# EasyEDA Pro project ProPrj_3PA1030_2025-11-07.epro

# Schematic Schematic1

## Sheets
1 ADC1: Board Name: Board1; Create Date: 2025-04-20; Page Name: ADC1; Project Name: 3PA1030; Schematic Name: Schematic1; Update Date: 2025-04-21; Company: 嘉立创EDA; Page Size: A4; Version: V1.0
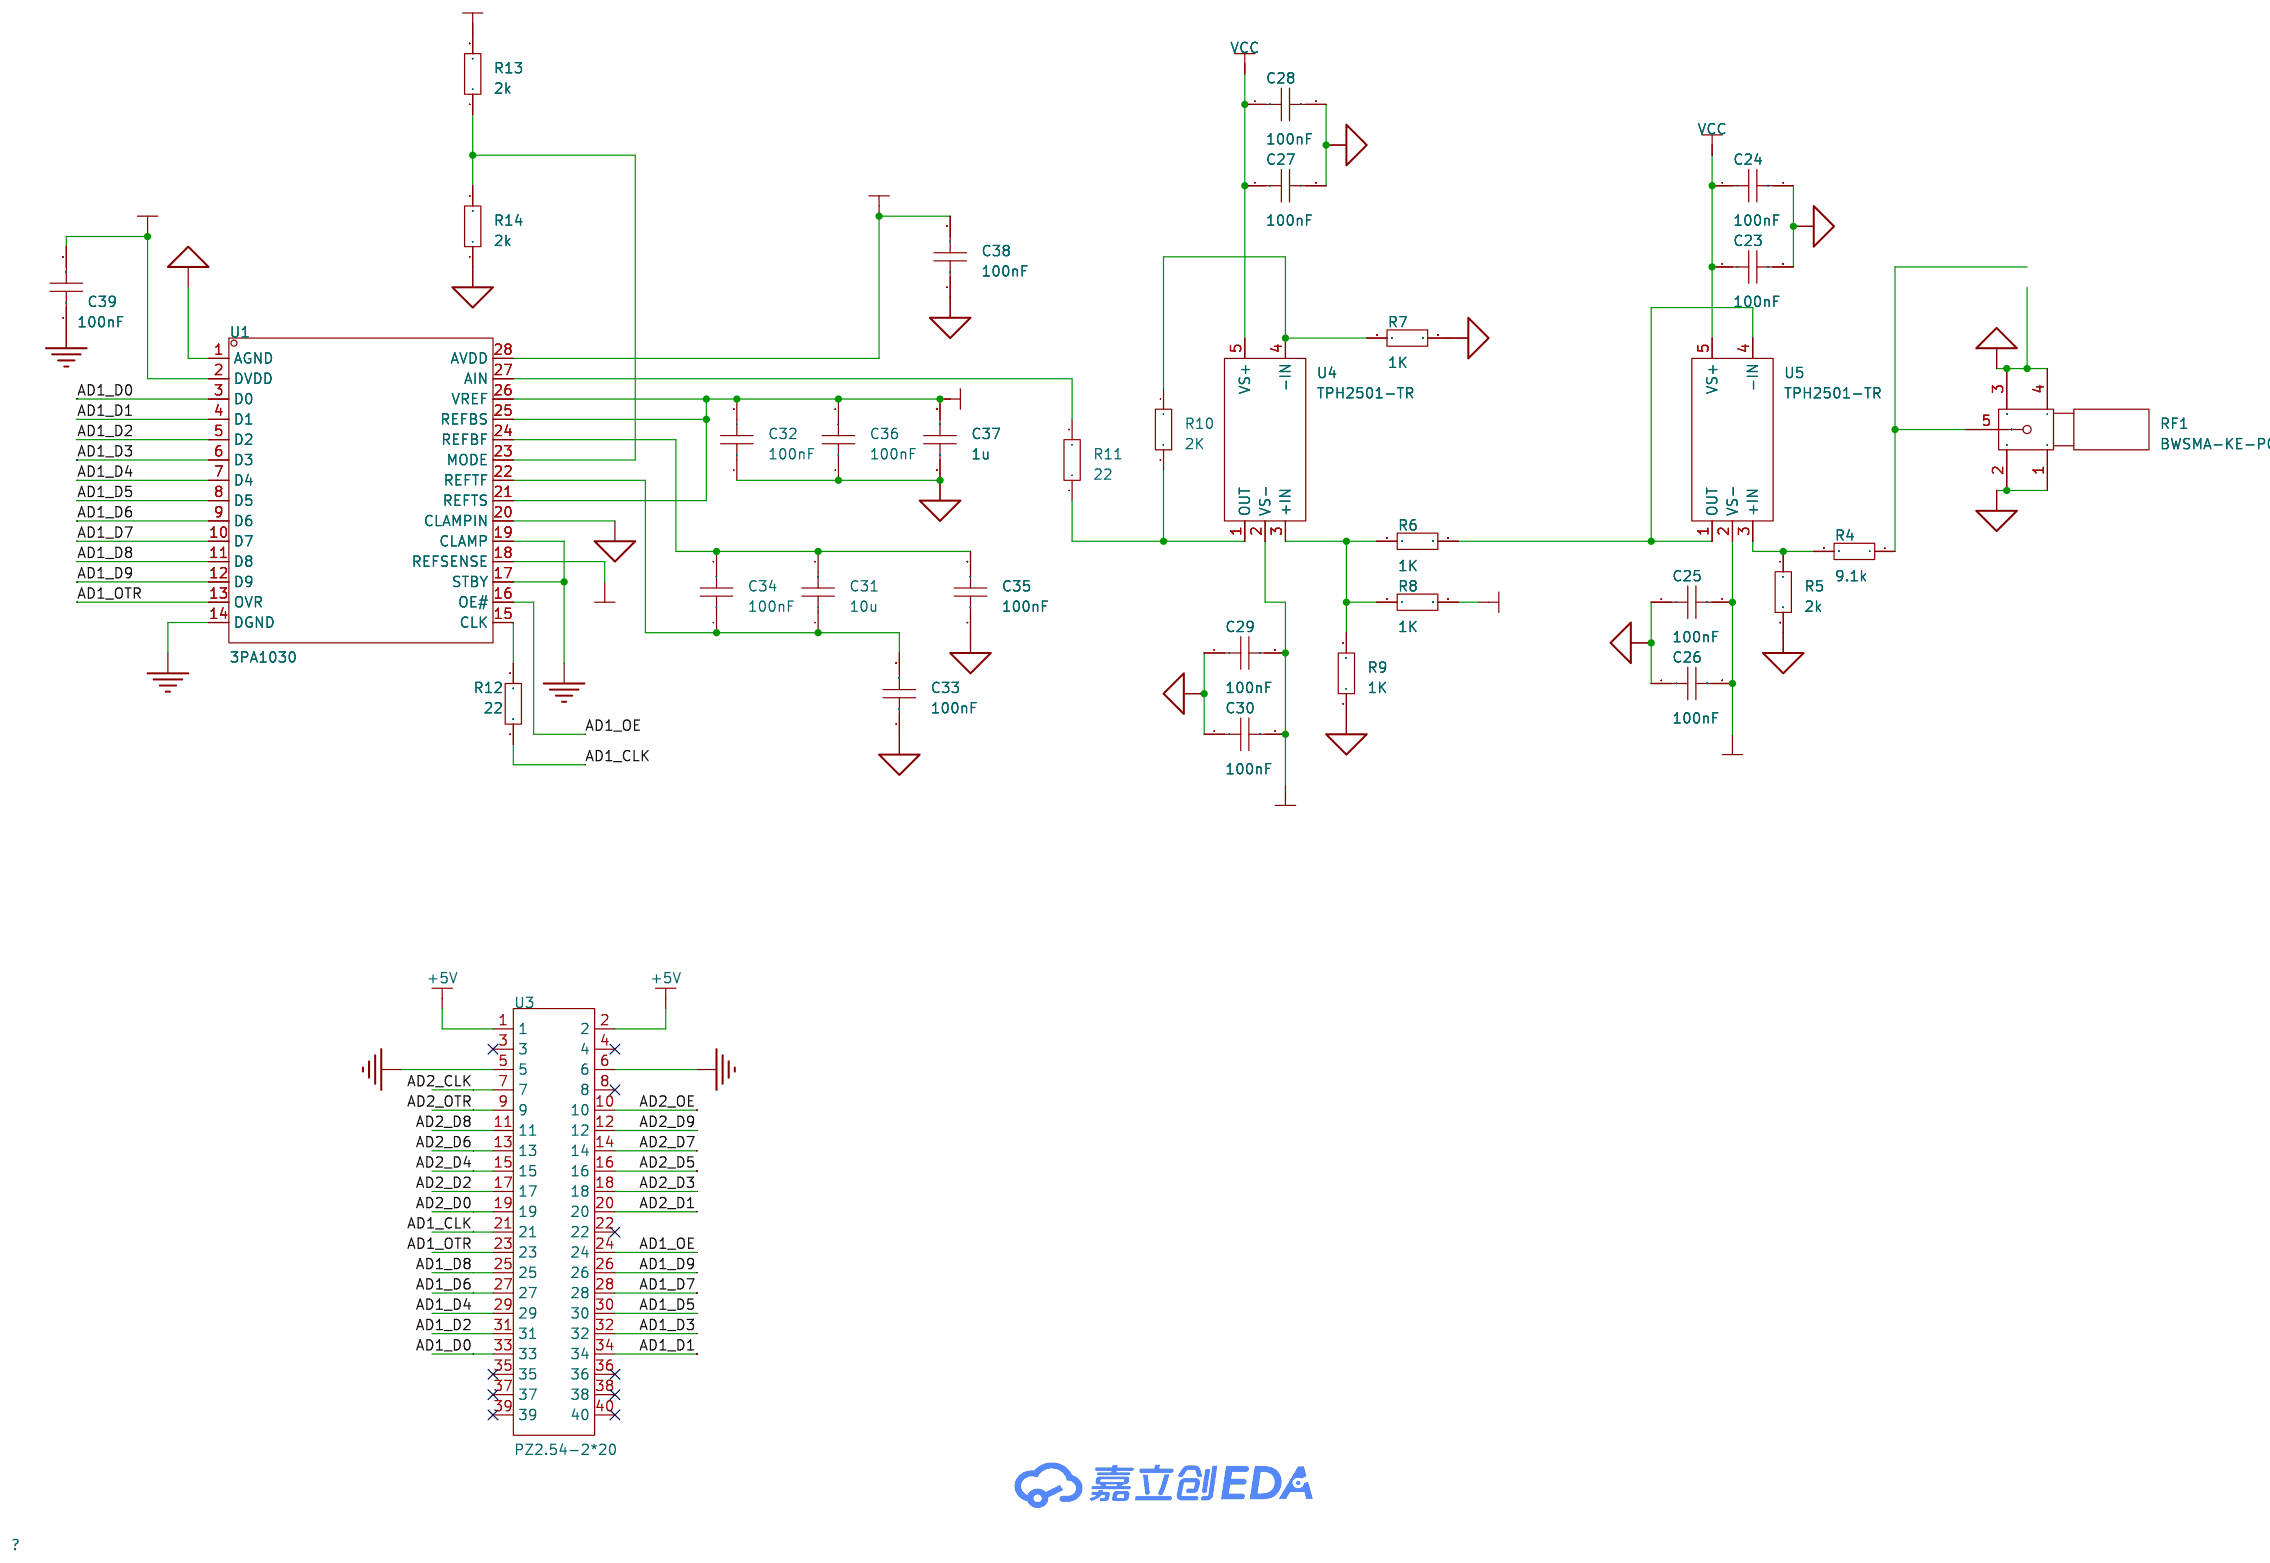
[diagram p0: ADC1]
2 POWER: Page Name: POWER; Update Date: 2025-04-20
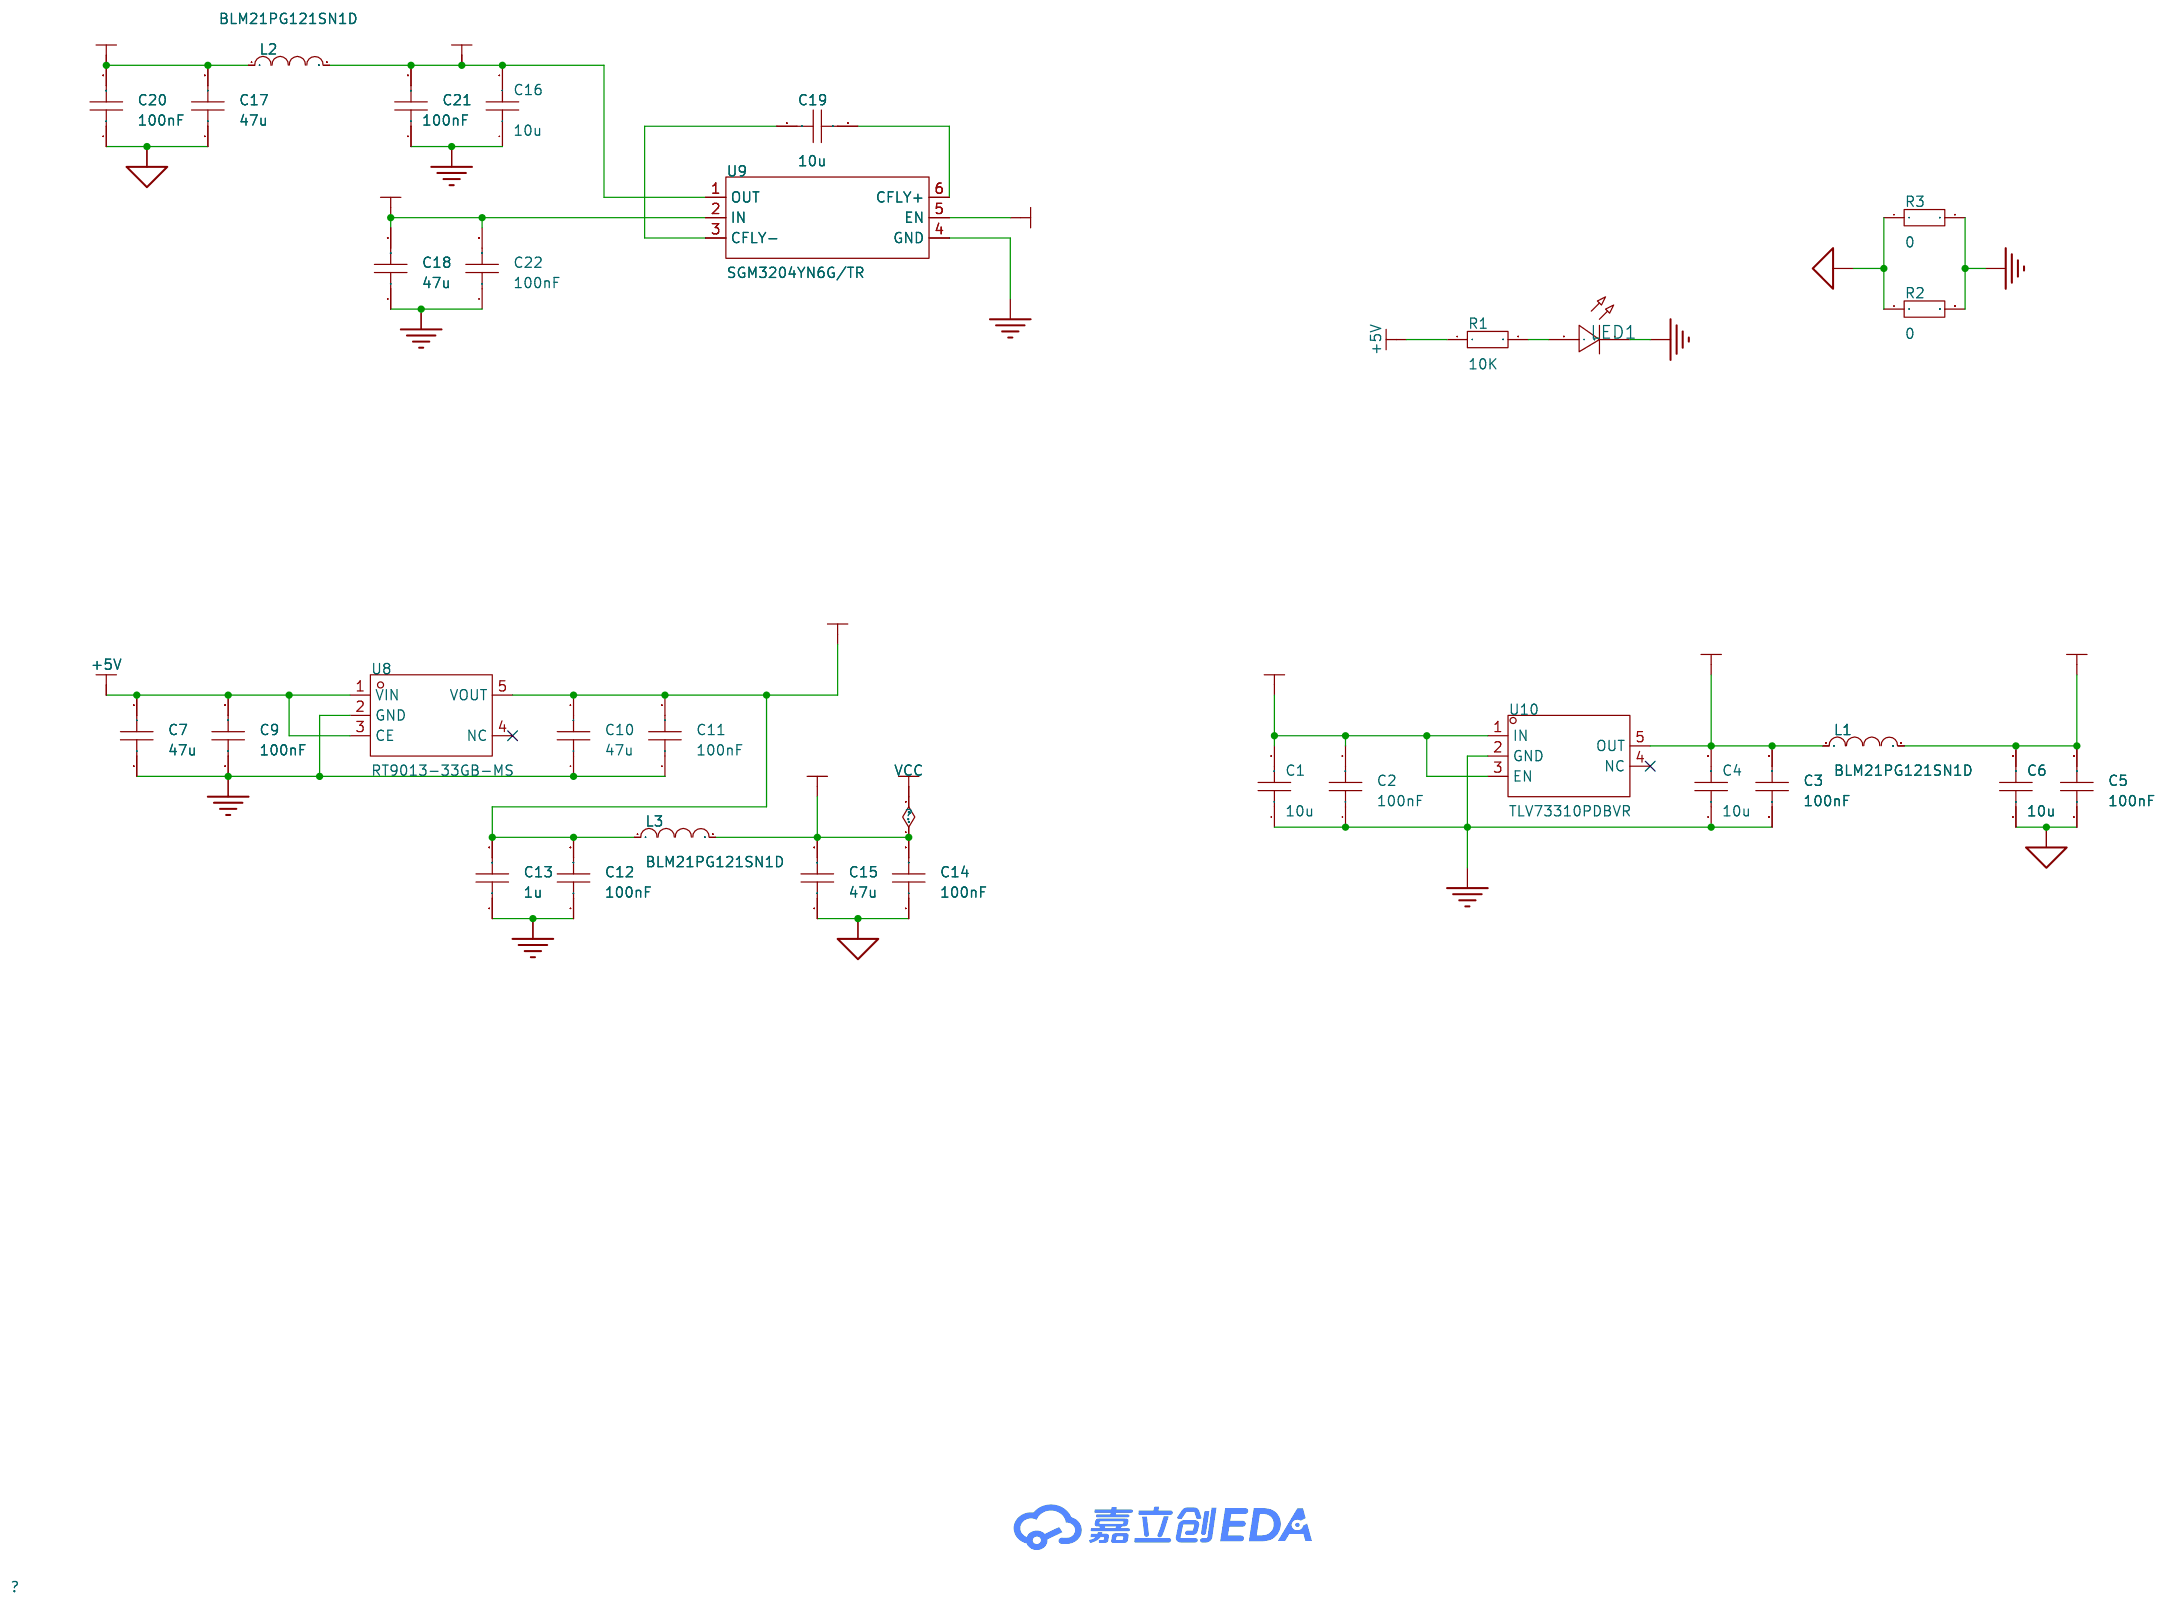
[diagram p1: POWER]
3 ADC2: Page Name: ADC2; Update Date: 2025-04-20
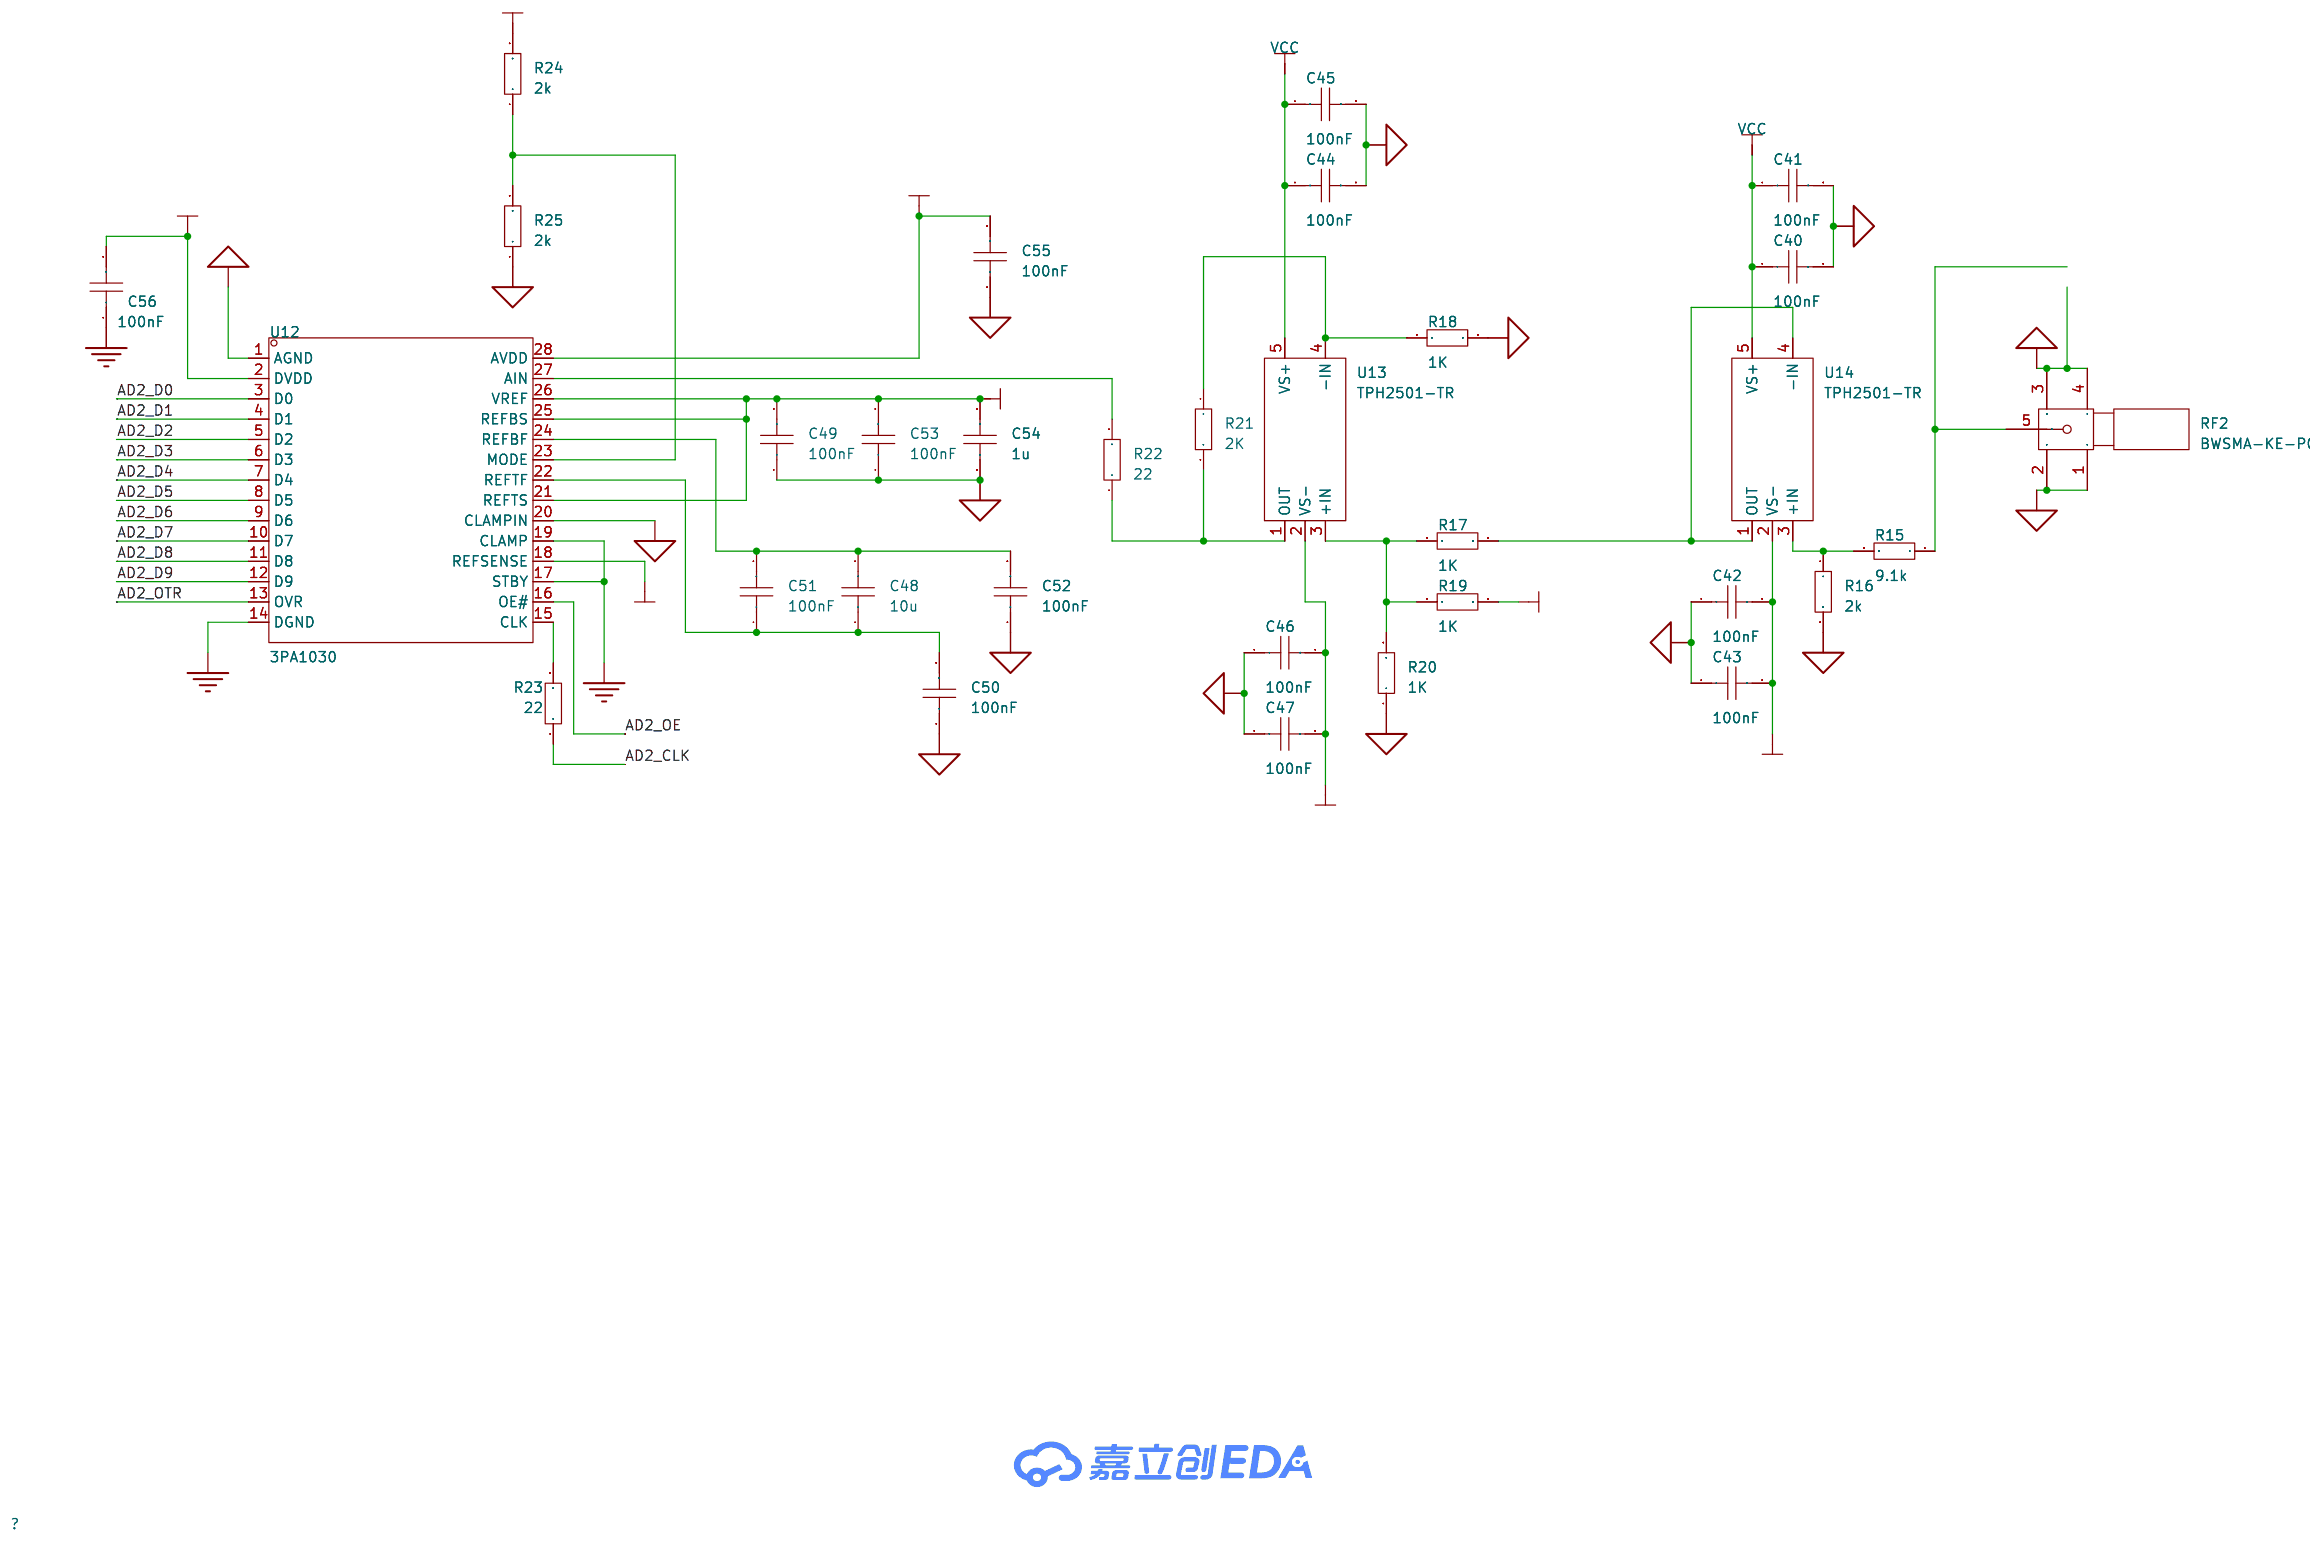
[diagram p2: ADC2]

## Parts
sheet ADC1
C23  100nF  [C0603]
C24  100nF  [C0603]
C25  100nF  [C0603]
C26  100nF  [C0603]
C27  100nF  [C0603]
C28  100nF  [C0603]
C29  100nF  [C0603]
C30  100nF  [C0603]
C31  10u  [C0805]
C32  100nF  [C0603]
C33  100nF  [C0603]
C34  100nF  [C0603]
C35  100nF  [C0603]
C36  100nF  [C0603]
C37  1u  [C0603]
C38  100nF  [C0603]
C39  100nF  [C0603]
R4  9.1k  [R0603]
R5  2k  [R0603]
R6  1K  [R0603]
R7  1K  [R0603]
R8  1K  [R0603]
R9  1K  [R0603]
R10  2K  [R0603]
R11  22  [R0603]
R12  22  [R0603]
R13  2k  [R0603]
R14  2k  [R0603]
RF1  BWSMA-KE-P001  [SMA-SMD_BWSMA-KE-P001]
U1  3PA1030  [TSSOP-28_L9.7-W4.4-P0.65-LS6.4-BL]
U3  PZ2.54-2*20  [HDR-TH_40P-P2.54-V-M-R2-C20-S2.54]
U4  TPH2501-TR  [SOT-23-5_L3.0-W1.7-P0.95-LS2.8-BR]
U5  TPH2501-TR  [SOT-23-5_L3.0-W1.7-P0.95-LS2.8-BR]
sheet ADC2
C40  100nF  [C0603]
C41  100nF  [C0603]
C42  100nF  [C0603]
C43  100nF  [C0603]
C44  100nF  [C0603]
C45  100nF  [C0603]
C46  100nF  [C0603]
C47  100nF  [C0603]
C48  10u  [C0805]
C49  100nF  [C0603]
C50  100nF  [C0603]
C51  100nF  [C0603]
C52  100nF  [C0603]
C53  100nF  [C0603]
C54  1u  [C0603]
C55  100nF  [C0603]
C56  100nF  [C0603]
R15  9.1k  [R0603]
R16  2k  [R0603]
R17  1K  [R0603]
R18  1K  [R0603]
R19  1K  [R0603]
R20  1K  [R0603]
R21  2K  [R0603]
R22  22  [R0603]
R23  22  [R0603]
R24  2k  [R0603]
R25  2k  [R0603]
RF2  BWSMA-KE-P001  [SMA-SMD_BWSMA-KE-P001]
U12  3PA1030  [TSSOP-28_L9.7-W4.4-P0.65-LS6.4-BL]
U13  TPH2501-TR  [SOT-23-5_L3.0-W1.7-P0.95-LS2.8-BR]
U14  TPH2501-TR  [SOT-23-5_L3.0-W1.7-P0.95-LS2.8-BR]
sheet POWER
C1  10u  [C1206]
C2  100nF  [C0603]
C3  100nF  [C0603]
C4  10u  [C1206]
C5  100nF  [C0603]
C6  10u  [C1206]
C7  47u  [C1206]
C9  100nF  [C0603]
C10  47u  [C1206]
C11  100nF  [C0603]
C12  100nF  [C0603]
C13  1u  [C0805]
C14  100nF  [C0603]
C15  47u  [C1206]
C16  10u  [C1206]
C17  47u  [C1206]
C18  47u  [C1206]
C19  10u  [C0805]
C20  100nF  [C0603]
C21  100nF  [C0603]
C22  100nF  [C0603]
L1  BLM21PG121SN1D  [L0805]
L2  BLM21PG121SN1D  [L0805]
L3  BLM21PG121SN1D  [L0805]
LED1  -  [LED_0603]
R1  10K  [R0603]
R2  0  [R0805]
R3  0  [R0805]
U8  RT9013-33GB-MS  [SOT-23-5_L2.9-W1.6-P0.95-LS2.8-BR]
U9  SGM3204YN6G/TR  [SOT-23-6_L2.9-W1.6-P0.95-LS2.8-BR]
U10  TLV73310PDBVR  [TSOT-23-5_L2.9-W1.6-P0.95-LS2.8-BR]

## Library data of the parts
C2 C3 C5 C9 C11 C12 C14 C20-C30 C32-C47 C49-C56 = CAP_0603: Supplier Footprint: 0603
C13 C19 C31 C48 = CAP_0805: Supplier Footprint: 0805
R1 R4-R25 = Res_0603: Supplier Footprint: 0603
RF1 RF2 = BWSMA-KE-P001: 连接器类型:板端;接口类型:内孔;端口数量:1;接口直径:5.2mm;接口长度/高度:-;频率-最大值:-;射频系列:SMA;阻抗:50Ω;样式:偏脚;工作温度范围:-;; LCSC Part Name: 内孔 SMA 偏脚; Supplier Part: C496550; Manufacturer: BAT WIRELESS(蝙蝠无线); Supplier Footprint: SMD; JLCPCB Part Class: 扩展库; Datasheet: https://atta.szlcsc.com/upload/public/pdf/source/20240320/28FD502871C976DFF213ABFCF2A0ED51.pdf; Supplier: LCSC; Connector Type: 板端; Interface Type: 内孔; Number of Ports: 1; Interface Diameter: 5.2mm; RF Series: SMA; Impedance: 50Ω; Style: 偏脚
U1 U12 = 3PA1030: 分辨率:10位;采样率:50MHz;电源电压:2.7V~5.5V;接口类型:-;; LCSC Part Name: 50MHz 10位ADC; Supplier Part: C248725; Manufacturer: 3PEAK(思瑞浦); Supplier Footprint: TSSOP-28; JLCPCB Part Class: 扩展库; Datasheet: https://atta.szlcsc.com/upload/public/pdf/source/20180820/C248725_75EFE3116FC07E3793E168E287E3107F.pdf; Supplier: LCSC; resolution: 10位; sampling frequency: 50MHz; Supply Voltage: 2.7V~5.5V; differential input: 是; Integral nonlinearity: 0.3LSB; Operating Temperature: -40℃~+85℃
U3 = PZ2.54-2*20: 插针结构:2x20P;间距:2.54mm;安装方式:直插;排数:双排;总PIN位数:40P;触头镀层:金;; LCSC Part Name: 2x20P 间距:2.54mm 直插; Supplier Part: C5224014; Manufacturer: ZHOURI(洲日); Supplier Footprint: 插件,P=2.54mm; JLCPCB Part Class: 扩展库; Datasheet: https://atta.szlcsc.com/upload/public/pdf/source/20221102/7E8316C38DB6D81BB18273F4CFF8B2F6.pdf; Supplier: LCSC; Pin Structure: 2x20P; Pitch: 2.54mm; Mounting Type: 直插; Number of Rows: 双排; Number of Pins: 40P; Contact Plating: 金
U4 U5 U13 U14 = TPH2501-TR: 放大器数:单路;轨到轨:轨到轨输入,轨到轨输出;增益带宽积(GBP):120MHz;输入失调电压(Vos):50uV;压摆率(SR):180V/us;输入偏置电流(Ib):0.3pA;; Supplier Part: C126713; Manufacturer: 3PEAK(思瑞浦); Supplier Footprint: SOT-23-5; JLCPCB Part Class: 扩展库; Datasheet: https://atta.szlcsc.com/upload/public/pdf/source/20180820/C248592_EC92046997BE718B1CFA256C8CC8079C.pdf; Supplier: LCSC; Number of Channels: 单路; Maximum Power Supply Range (Vdd-Vss): 5.5V; Rail to Rail: 轨到轨输入,轨到轨输出; Gain Bandwidth Product: 120MHz; Vos - Input Offset Voltage: 50uV; Input Offset Voltage Drift(Vos TC): 2uV/℃; Slew Rate: 180V/us; Ib - Input Bias Current: 0.3pA; Noise density(eN): 6.5nV/√Hz@1MHz; Common Mode Rejection Ratio(CMRR): 85dB; Quiescent Current: 6.5mA; Operating Temperature: -40℃~+125℃
C1 C4 C6 C7 C10 C15-C18 = CAP_1206: Supplier Footprint: 1206
L1-L3 = BLM21PG121SN1D: 标称阻抗@测试频率:120Ω@100MHz;误差:±25%;直流电阻(RDC):30mΩ;; LCSC Part Name: 单路 0805磁珠 阻抗120Ω@100MHz; Supplier Part: C79382; Manufacturer: muRata(村田); Supplier Footprint: 0805; JLCPCB Part Class: 扩展库; Datasheet: https://atta.szlcsc.com/upload/public/pdf/source/20180326/C118443_3FAC30E9A4F0E6B81275543C61E0685E.pdf; Supplier: LCSC; Impedance @ Frequency: 120Ω@100MHz; Tolerance: ±25%; DC Resistance: 30mΩ; Current Rating: 3A; Circuits: 1
LED1 = LED_0603-R: Supplier Footprint: 0603
R2 R3 = Res_0805: Supplier Footprint: 0805
U8 = RT9013-33GB-MS: 输出类型:固定;最大输入电压:5.5V;输出电压:3.3V;最大输出电流:500mA;电源纹波抑制比(PSRR):75dB@(1kHz);输出极性:正极;; Supplier Part: C7434207; Manufacturer: MSKSEMI(美森科); Supplier Footprint: SOT-23-5; JLCPCB Part Class: 扩展库; Datasheet: https://atta.szlcsc.com/upload/public/pdf/source/20230705/1D6536D82D93AC1E044F3DAE104751D9.pdf; Supplier: LCSC; Output Type: 固定; Maximum Input Voltage: 5.5V; Output Voltage: 3.3V; MAX Output Current: 500mA; Power Supply Rejection Ratio (PSRR): 75dB@(1kHz); Output Polarity: 正极
U9 = SGM3204YN6G/TR: 电荷泵芯片，开关电容式电压变换器，最大输出200mA,可用于运放放大、滤波等电路; Supplier Part: C194031; Manufacturer: SGMICRO(圣邦微); Supplier Footprint: SOT-23-6; JLCPCB Part Class: 扩展库; Datasheet: https://atta.szlcsc.com/upload/public/pdf/source/20180627/C194031_755051E53122D645C36CF727711B963E.pdf; Supplier: LCSC
U10 = TLV73310PDBVR: 输出类型:固定;最大输入电压:5.5V;输出电压:1V;输出电流:300mA;电源纹波抑制比(PSRR):68dB;输出极性:正极;; LCSC Part Name: 具有使能功能的 300mA、低 IQ、低压降无电容稳压器; Supplier Part: C83352; Manufacturer: TI(德州仪器); Supplier Footprint: SOT-23-5; JLCPCB Part Class: 扩展库; Datasheet: https://www.ti.com/cn/lit/gpn/tlv733p; Supplier: LCSC; Output Type: 固定; Maximum Input Voltage: 5.5V; Output Voltage: 1V; Output Current: 300mA; Power Supply Rejection Ratio (PSRR): 68dB; Dropout Voltage: 450mV@(300mA); standby current: 60uA; Feature: 防静电保护；浪涌保护；低ESR；热保护(TSD)；欠压闭锁；过流保护(OCP)；带使能; Operating Temperature: -40℃~+125℃@(Tj); Output Polarity: 正极; Number of Outputs: 1

## Nets
+5V: C7.2 C9.2 R1.1 U3.1 U3.2 U8.1(VIN) U8.3(CE)
-3V3: C16.2 C21.2 L2.2 U9.1(OUT)
A1V: C5.2 C6.2 C32.2 C36.2 C37.2 C49.2 C53.2 C54.2 L1.2 R8.2 R19.2 U1.21(REFTS) U1.25(REFBS) U1.26(VREF) U12.21(REFTS) U12.25(REFBS) U12.26(VREF)
A3V3: C14.2 C15.2 C23.1 C24.1 C27.1 C28.1 C38.2 C40.1 C41.1 C44.1 C45.1 C55.2 L3.2 R13.2 R24.2 U1.18(REFSENSE) U1.28(AVDD) U4.5(VS+) U5.5(VS+) U12.18(REFSENSE) U12.28(AVDD) U13.5(VS+) U14.5(VS+)
AGND: C5.1 C6.1 C14.1 C15.1 C17.1 C20.1 C23.2 C24.2 C25.1 C26.1 C27.2 C28.2 C29.1 C30.1 C32.1 C33.1 C35.1 C36.1 C37.1 C38.1 C40.2 C41.2 C42.1 C43.1 C44.2 C45.2 C46.1 C47.1 C49.1 C50.1 C52.1 C53.1 C54.1 C55.1 R2.1 R3.1 R5.2 R7.2 R9.1 R14.1 R16.2 R18.2 R20.1 R25.1 RF1.1 RF1.2 RF1.3 RF1.4 RF2.1 RF2.2 RF2.3 RF2.4 U1.1(AGND) U1.20(CLAMPIN) U12.1(AGND) U12.20(CLAMPIN)
D1V: C3.2 C4.2 L1.1 U10.5(OUT)
D3V3: C1.2 C2.2 C10.2 C11.2 C12.2 C13.2 C18.2 C22.2 C39.2 C56.2 L3.1 U1.2(DVDD) U8.5(VOUT) U9.2(IN) U9.5(EN) U10.1(IN) U10.3(EN) U12.2(DVDD)
GND: C1.1 C2.1 C3.1 C4.1 C7.1 C9.1 C10.1 C11.1 C12.1 C13.1 C16.1 C18.1 C21.1 C22.1 C39.1 C56.1 LED1.1(C) R2.2 R3.2 U1.14(DGND) U1.17(STBY) U1.19(CLAMP) U3.5 U3.6 U8.2(GND) U9.4(GND) U10.2(GND) U12.14(DGND) U12.17(STBY) U12.19(CLAMP)
VEE: C17.2 C20.2 C25.2 C26.2 C29.2 C30.2 C42.2 C43.2 C46.2 C47.2 L2.1 U4.2(VS-) U5.2(VS-) U13.2(VS-) U14.2(VS-)
AD1_CLK: R12.1 U3.21
AD1_D0: U1.3(D0) U3.33
AD1_D1: U1.4(D1) U3.34
AD1_D2: U1.5(D2) U3.31
AD1_D3: U1.6(D3) U3.32
AD1_D4: U1.7(D4) U3.29
AD1_D5: U1.8(D5) U3.30
AD1_D6: U1.9(D6) U3.27
AD1_D7: U1.10(D7) U3.28
AD1_D8: U1.11(D8) U3.25
AD1_D9: U1.12(D9) U3.26
AD1_OE: U1.16(OE#) U3.24
AD1_OTR: U1.13(OVR) U3.23
AD2_CLK: R23.1 U3.7
AD2_D0: U3.19 U12.3(D0)
AD2_D1: U3.20 U12.4(D1)
AD2_D2: U3.17 U12.5(D2)
AD2_D3: U3.18 U12.6(D3)
AD2_D4: U3.15 U12.7(D4)
AD2_D5: U3.16 U12.8(D5)
AD2_D6: U3.13 U12.9(D6)
AD2_D7: U3.14 U12.10(D7)
AD2_D8: U3.11 U12.11(D8)
AD2_D9: U3.12 U12.12(D9)
AD2_OE: U3.10 U12.16(OE#)
AD2_OTR: U3.9 U12.13(OVR)
$1N3788: R4.2 R5.1 U5.3(+IN)
$1N3795: R4.1 RF1.5
$1N3801: R6.2 U5.1(OUT) U5.4(-IN)
$1N4223: R6.1 R8.1 R9.2 U4.3(+IN)
$1N4309: R7.1 R10.1 U4.4(-IN)
$1N5649: R11.2 U1.27(AIN)
$1N5655: R10.2 R11.1 U4.1(OUT)
$1N5774: C31.2 C34.2 C35.2 U1.24(REFBF)
$1N5832: R13.1 R14.2 U1.23(MODE)
$1N5839: C31.1 C33.2 C34.1 U1.22(REFTF)
$1N5992: R12.2 U1.15(CLK)
$2N1318: C19.1 U9.3(CFLY-)
$2N1401: C19.2 U9.6(CFLY+)
$2N1421: LED1.2(A) R1.2
$3N1432: R15.2 R16.1 U14.3(+IN)
$3N1436: R15.1 RF2.5
$3N1441: R17.2 U14.1(OUT) U14.4(-IN)
$3N1463: R17.1 R19.1 R20.2 U13.3(+IN)
$3N1473: R18.1 R21.1 U13.4(-IN)
$3N1502: R22.2 U12.27(AIN)
$3N1505: R21.2 R22.1 U13.1(OUT)
$3N1522: C48.2 C51.2 C52.2 U12.24(REFBF)
$3N1528: R24.1 R25.2 U12.23(MODE)
$3N1534: C48.1 C50.2 C51.1 U12.22(REFTF)
$3N1555: R23.2 U12.15(CLK)

Not connected (* = marked no-connect by the designer): U3 3* 4* 8* 22* 35* 36* 37* 38* 39* 40*; U8 4(NC)*; U10 4(NC)*

# Board PCB1
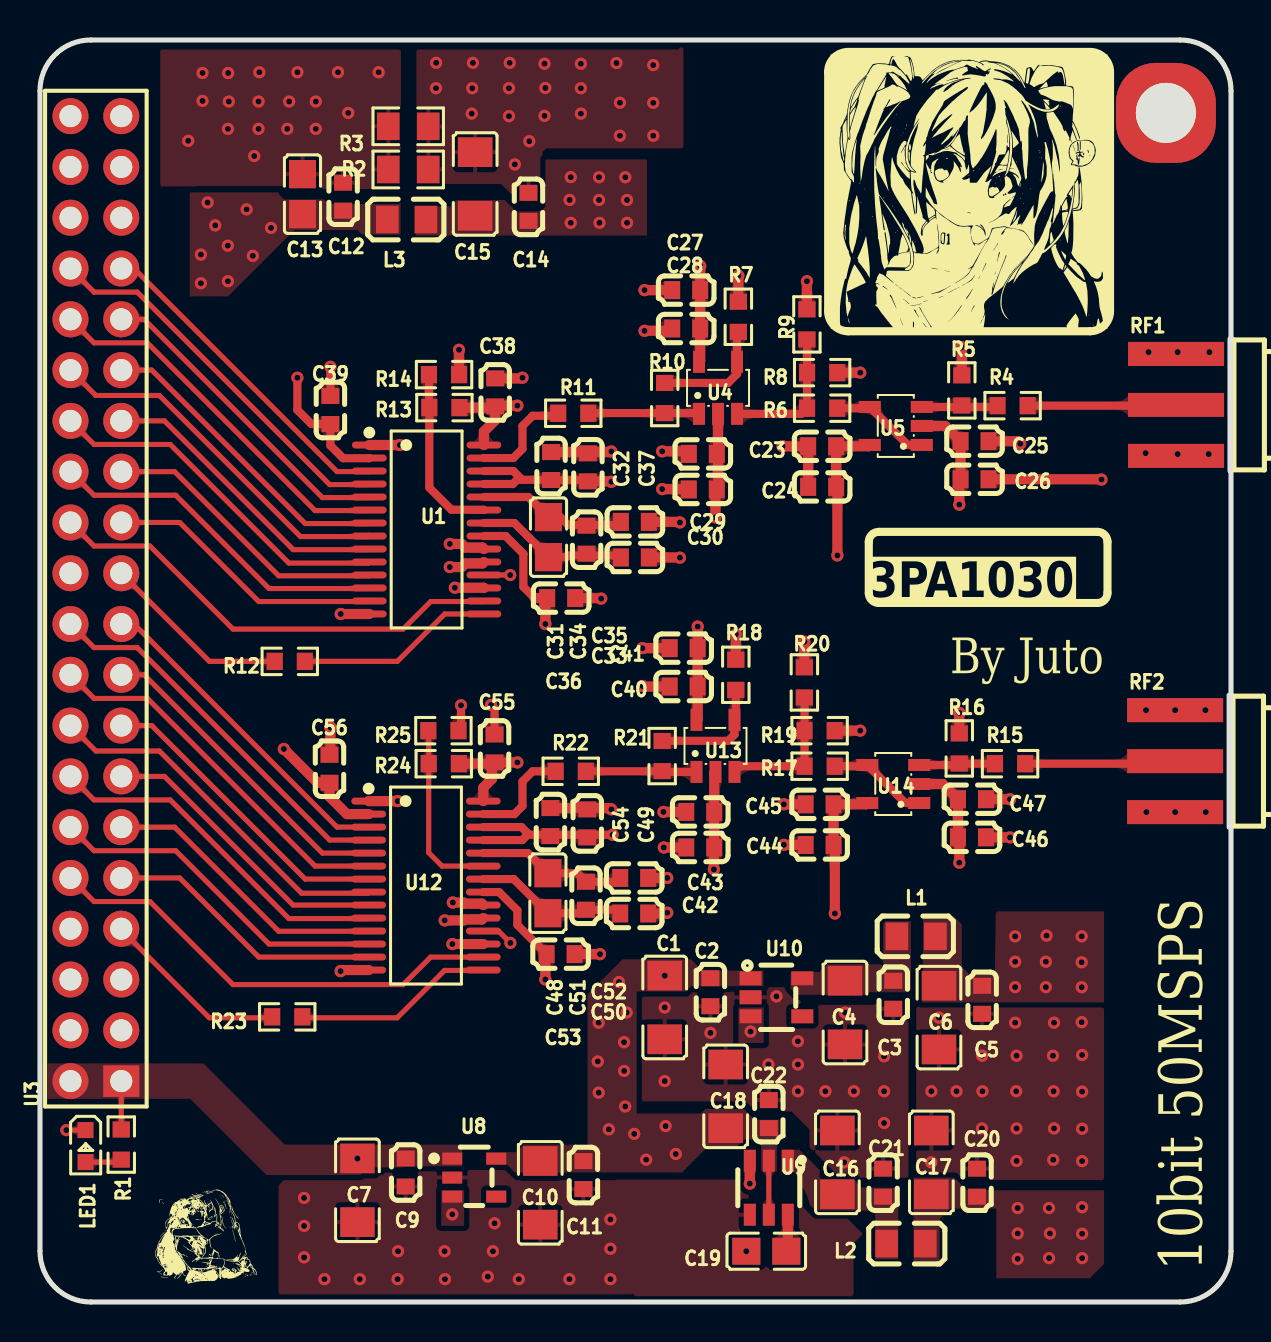
[diagram p3: board, top side]
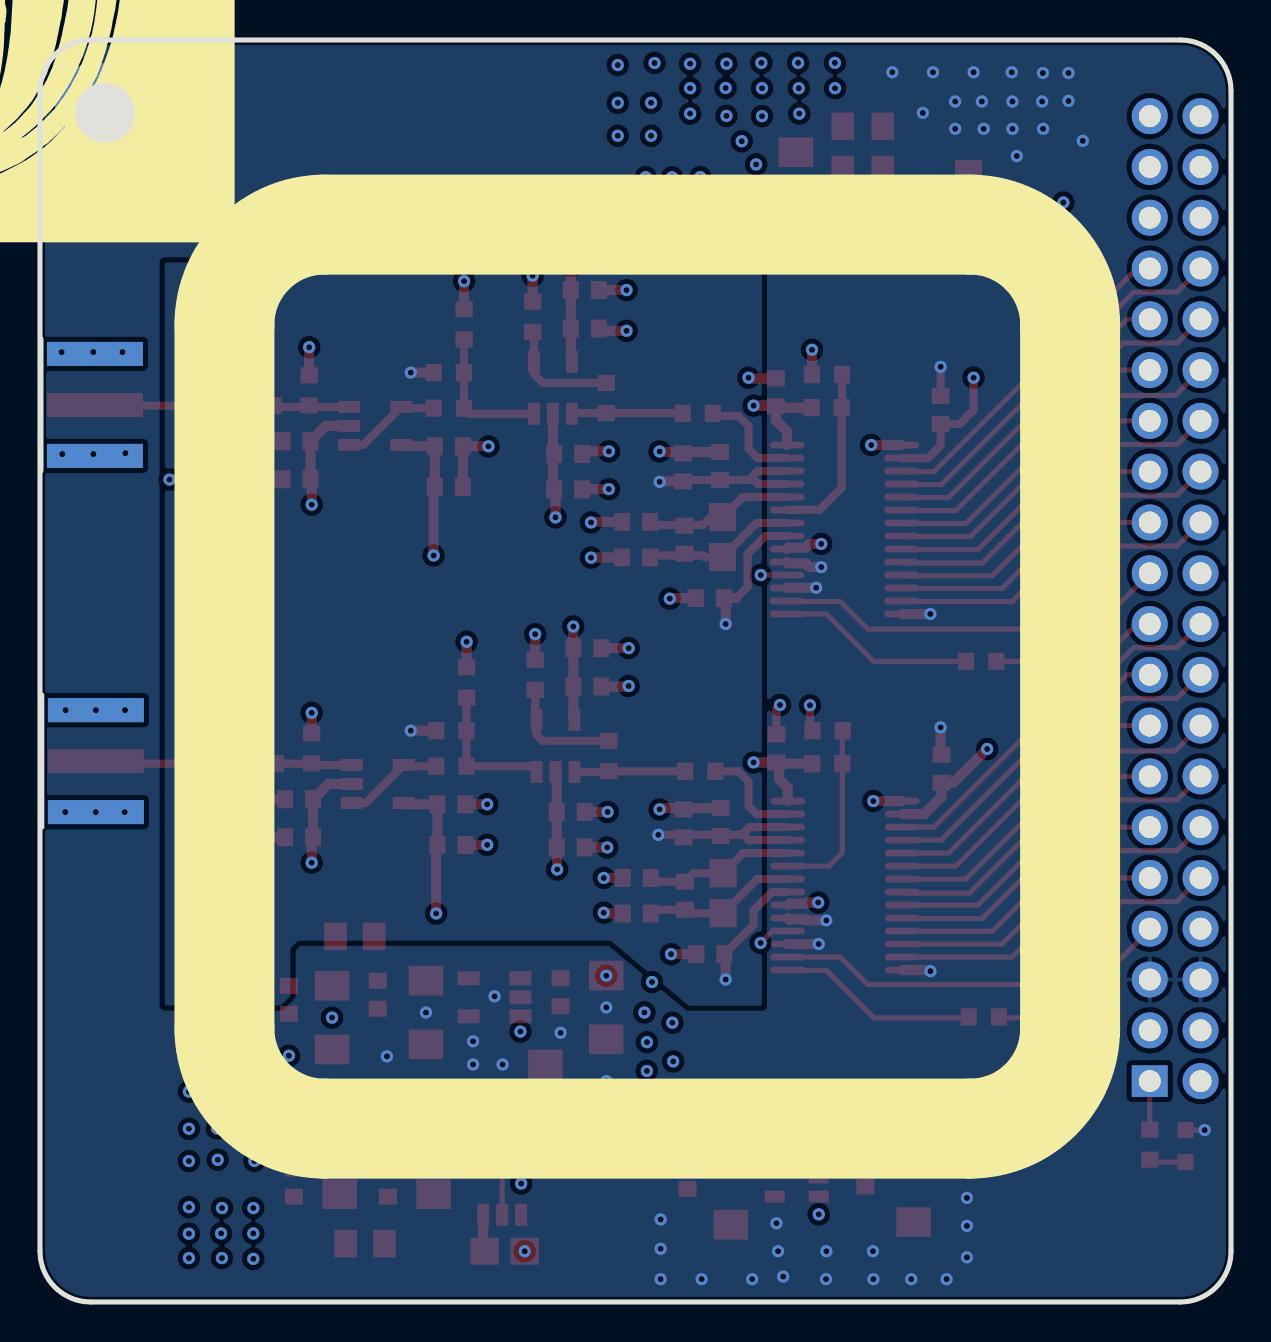
[diagram p4: board, bottom side, seen from below]

Outline 59.56 x 63.12 mm; copper layers: Top Layer, Inner1, Inner2, Bottom Layer. Coordinates in mm from the lower left corner of the outline.
Outline path: 0,60.58 0,2.54 arc(0.74,0.74) 2.54,0 57.02,0 arc(58.82,0.74) 59.56,2.54 59.56,60.58 arc(58.82,62.38) 57.02,63.12 2.54,63.12 arc(0.74,62.38) 0,60.58
Stack: Top Layer 0.035mm 外层铜厚1oz / Dielectric1 0.2104mm 7628 RC49% 8.6mil / Inner1 0.0152mm 内层铜厚 / Dielectric2 1.065mm 1.1mm H/HOZ Copper / Inner2 0.0152mm 内层铜厚 / Dielectric3 0.2104mm 7628 RC49% 8.6mil / Bottom Layer 0.035mm 外层铜厚1oz

## Design rules (mm)
template: JLCPCB Capability(Two Layers Board)
spacing copperThickness1oz (default): track to track 0.102, other pairs 0.152 to 0.3
spacing copperThickness2oz: track to track 0.203, other pairs 0.152 to 0.3
track width copperThickness1oz (default): min 0.127, default 0.254, max 2.54
track width copperThickness2oz: min 0.203, default 0.254, max 2.54
differential pair differentialPair (default): width min 0.127, default 0.254, max 2.54; gap min 0.152, default 0.152
via viaSize (default): diameter min 0.5, default 0.61, max 10; hole min 0.3, default 0.305, max 6.3

## Placement (name value [footprint] x y rotation side)
C1  10u  [C1206]  31.24 14.73 90 top
C2  100nF  [C0603]  33.53 15.49 90 top
C3  100nF  [C0603]  42.67 15.37 90 top
C4  10u  [C1206]  40.26 14.48 90 top
C5  100nF  [C0603]  47.12 15.11 90 top
C6  10u  [C1206]  44.96 14.22 90 top
C7  47u  [C1206]  15.88 5.59 90 top
C9  100nF  [C0603]  18.29 6.48 90 top
C10  47u  [C1206]  25.02 5.46 90 top
C11  100nF  [C0603]  27.18 6.35 90 top
C12  100nF  [C0603]  15.16 55.28 270 top
C13  1u  [C0805]  13.13 55.41 270 top
C14  100nF  [C0603]  24.43 54.77 270 top
C15  47u  [C1206]  21.76 55.92 270 top
C16  10u  [C1206]  39.88 6.98 270 top
C17  47u  [C1206]  44.58 6.98 270 top
C18  47u  [C1206]  34.29 10.29 270 top
C19  10u  [C0805]  36.32 2.54 0 top
C20  100nF  [C0603]  46.86 5.97 270 top
C21  100nF  [C0603]  42.16 5.97 270 top
C22  100nF  [C0603]  36.45 9.4 270 top
C23  100nF  [C0603]  39.12 42.8 180 top
C24  100nF  [C0603]  39.12 40.77 180 top
C25  100nF  [C0603]  46.74 43.05 180 top
C26  100nF  [C0603]  46.74 41.15 180 top
C27  100nF  [C0603]  32.32 50.61 180 top
C28  100nF  [C0603]  32.32 48.69 180 top
C29  100nF  [C0603]  33.15 42.42 0 top
C30  100nF  [C0603]  33.15 40.64 0 top
C31  10u  [C0805]  25.43 38.25 90 top
C32  100nF  [C0603]  25.56 41.81 270 top
C33  100nF  [C0603]  29.75 37.24 180 top
C34  100nF  [C0603]  27.34 38.13 90 top
C35  100nF  [C0603]  29.75 39.02 180 top
C36  100nF  [C0603]  26.07 35.21 180 top
C37  1u  [C0603]  27.4 41.75 270 top
C38  100nF  [C0603]  22.76 45.49 270 top
C39  100nF  [C0603]  14.52 44.61 270 top
C40  100nF  [C0603]  32.19 30.78 180 top
C41  100nF  [C0603]  32.19 32.7 180 top
C42  100nF  [C0603]  33.02 22.73 0 top
C43  100nF  [C0603]  33.02 24.51 0 top
C44  100nF  [C0603]  38.99 22.86 180 top
C45  100nF  [C0603]  38.99 24.89 180 top
C46  100nF  [C0603]  46.61 23.24 180 top
C47  100nF  [C0603]  46.61 25.15 180 top
C48  10u  [C0805]  25.4 20.45 90 top
C49  100nF  [C0603]  27.37 23.94 270 top
C50  100nF  [C0603]  29.72 19.43 180 top
C51  100nF  [C0603]  27.31 20.32 90 top
C52  100nF  [C0603]  29.72 21.21 180 top
C53  100nF  [C0603]  26.03 17.4 180 top
C54  1u  [C0603]  25.53 24 270 top
C55  100nF  [C0603]  22.73 27.69 270 top
C56  100nF  [C0603]  14.48 26.67 270 top
L1  BLM21PG121SN1D  [L0805]  43.81 18.29 0 top
L2  BLM21PG121SN1D  [L0805]  43.31 2.92 180 top
L3  BLM21PG121SN1D  [L0805]  18.33 54.14 0 top
LED1  -  [LED_0603]  2.29 7.75 270 top
NOREF  -  [Pad_e1381]  56.31 59.47 0 top
R1  10K  [R0603]  4.06 7.87 270 top
R2  0  [R0805]  18.41 56.64 180 top
R3  0  [R0805]  18.41 58.8 180 top
R4  9.1k  [R0603]  48.64 44.83 180 top
R5  2k  [R0603]  46.1 45.59 90 top
R6  1K  [R0603]  39.12 44.7 0 top
R7  1K  [R0603]  34.92 49.28 90 top
R8  1K  [R0603]  39.12 46.48 0 top
R9  1K  [R0603]  38.35 48.89 270 top
R10  2K  [R0603]  31.24 45.21 270 top
R11  22  [R0603]  26.67 44.45 180 top
R12  22  [R0603]  12.49 32.04 0 top
R13  2k  [R0603]  20.22 44.73 0 top
R14  2k  [R0603]  20.21 46.38 180 top
R15  9.1k  [R0603]  48.51 26.92 180 top
R16  2k  [R0603]  45.97 27.69 90 top
R17  1K  [R0603]  38.99 26.8 0 top
R18  1K  [R0603]  34.8 31.37 90 top
R19  1K  [R0603]  38.99 28.58 0 top
R20  1K  [R0603]  38.23 30.99 270 top
R21  2K  [R0603]  31.11 27.3 270 top
R22  22  [R0603]  26.54 26.54 180 top
R23  22  [R0603]  12.36 14.26 0 top
R24  2k  [R0603]  20.19 26.92 0 top
R25  2k  [R0603]  20.18 28.58 180 top
RF1  BWSMA-KE-P001  [SMA-SMD_BWSMA-KE-P001]  56.81 44.87 0 top
RF2  BWSMA-KE-P001  [SMA-SMD_BWSMA-KE-P001]  56.77 27.05 0 top
U1  3PA1030  [TSSOP-28_L9.7-W4.4-P0.65-LS6.4-BL]  19.34 38.64 270 top
U3  PZ2.54-2*20  [HDR-TH_40P-P2.54-V-M-R2-C20-S2.54]  2.79 35.18 90 top
U4  TPH2501-TR  [SOT-23-5_L3.0-W1.7-P0.95-LS2.8-BR]  33.91 45.72 270 top
U5  TPH2501-TR  [SOT-23-5_L3.0-W1.7-P0.95-LS2.8-BR]  42.8 43.81 0 top
U8  RT9013-33GB-MS  [SOT-23-5_L2.9-W1.6-P0.95-LS2.8-BR]  21.72 6.22 180 top
U9  SGM3204YN6G/TR  [SOT-23-6_L2.9-W1.6-P0.95-LS2.8-BR]  36.45 5.72 90 top
U10  TLV73310PDBVR  [TSOT-23-5_L2.9-W1.6-P0.95-LS2.8-BR]  36.83 15.24 180 top
U12  3PA1030  [TSSOP-28_L9.7-W4.4-P0.65-LS6.4-BL]  19.3 20.83 270 top
U13  TPH2501-TR  [SOT-23-5_L3.0-W1.7-P0.95-LS2.8-BR]  33.78 27.81 270 top
U14  TPH2501-TR  [SOT-23-5_L3.0-W1.7-P0.95-LS2.8-BR]  42.67 25.91 0 top

## Footprints (pads in the part's own frame, mm; a bottom-side part is the same pattern mirrored in y, then rotated)
C0603
  rect 0.8x0.9 smd: 1(-0.7,0) 2(0.7,0)
C0805
  rect 1.41x1.35 smd: 1(-1,0) 2(1,0)
C1206
  rect 1.485x1.728 smd: 1(-1.593,0) 2(1.593,0)
HDR-TH_40P-P2.54-V-M-R2-C20-S2.54
  rect 1.575x1.8 hole 1.1: 1(-24.13,-1.27)
  round 1.8 hole 1.1: 2(-24.13,1.27) 3(-21.59,-1.27) 4(-21.59,1.27) 5(-19.05,-1.27) 6(-19.05,1.27) 7(-16.51,-1.27) 8(-16.51,1.27) 9(-13.97,-1.27) 10(-13.97,1.27) 11(-11.43,-1.27) 12(-11.43,1.27) 13(-8.89,-1.27) 14(-8.89,1.27) 15(-6.35,-1.27) 16(-6.35,1.27) 17(-3.81,-1.27) 18(-3.81,1.27) 19(-1.27,-1.27) 20(-1.27,1.27) 21(1.27,-1.27) 22(1.27,1.27) 23(3.81,-1.27) 24(3.81,1.27) 25(6.35,-1.27) 26(6.35,1.27) 27(8.89,-1.27) 28(8.89,1.27) 29(11.43,-1.27) 30(11.43,1.27) 31(13.97,-1.27) 32(13.97,1.27) 33(16.51,-1.27) 34(16.51,1.27) 35(19.05,-1.27) 36(19.05,1.27) 37(21.59,-1.27) 38(21.59,1.27) 39(24.13,-1.27) 40(24.13,1.27)
L0805
  rect 1.133x1.377 smd: 1(-0.966,0) 2(0.966,0)
LED_0603
  rect 0.8x0.8 smd: 1(-0.851,-0.01) 2(0.75,-0.005)
Pad_e1381
  rrect 5x5 hole 3: 1(0,0)
R0603
  rect 0.806x0.864 smd: 1(-0.753,0) 2(0.753,0)
R0805
  rect 1.133x1.377 smd: 1(-1,0) 2(1,0)
SMA-SMD_BWSMA-KE-P001
  rect 4.8x1.2 smd: 1(0,-2.55) 2(0,2.55) 5(0,0)
  rect 4.8x1.2 smd far side: 3(0,2.55) 4(0,-2.55)
SOT-23-5_L2.9-W1.6-P0.95-LS2.8-BR
  rect 1x0.6 smd: 1(1.1,-0.95) 2(1.1,0) 3(1.1,0.95) 4(-1.1,0.95) 5(-1.1,-0.95)
SOT-23-5_L3.0-W1.7-P0.95-LS2.8-BR
  rect 1.1x0.6 smd: 1(1.3,-0.95) 2(1.3,0) 3(1.3,0.95) 4(-1.3,0.95) 5(-1.3,-0.95)
SOT-23-6_L2.9-W1.6-P0.95-LS2.8-BR
  rect 1.1x0.6 smd: 1(1.35,-0.95) 2(1.35,0) 3(1.35,0.95) 4(-1.35,0.95) 5(-1.35,0) 6(-1.35,-0.95)
TSOT-23-5_L2.9-W1.6-P0.95-LS2.8-BR
  rect 1.1x0.7 smd: 1(1.294,-0.951) 2(1.294,-0.001) 3(1.294,0.951) 4(-1.294,0.951) 5(-1.294,-0.949)
TSSOP-28_L9.7-W4.4-P0.65-LS6.4-BL
  oval 0.343x1.732 smd: 1(-4.225,-2.866) 2(-3.575,-2.866) 3(-2.925,-2.866) 4(-2.275,-2.866) 5(-1.625,-2.866) 6(-0.975,-2.866) 7(-0.325,-2.866) 8(0.325,-2.866) 9(0.975,-2.866) 10(1.625,-2.866) 11(2.275,-2.866) 12(2.925,-2.866) 13(3.575,-2.866) 14(4.225,-2.866) 15(4.225,2.866) 16(3.575,2.866) 17(2.925,2.866) 18(2.275,2.866) 19(1.625,2.866) 20(0.975,2.866) 21(0.325,2.866) 22(-0.325,2.866) 23(-0.975,2.866) 24(-1.625,2.866) 25(-2.275,2.866) 26(-2.925,2.866) 27(-3.575,2.866) 28(-4.225,2.866)

## Nets
As in the schematic, except:
GND: C1.1 C2.1 C3.1 C4.1 C7.1 C9.1 C10.1 C11.1 C12.1 C13.1 C16.1 C18.1 C21.1 C22.1 C39.1 C56.1 LED1.1 NOREF.1 R2.2 R3.2 U1.14 U1.17 U1.19 U3.5 U3.6 U8.2 U9.4 U10.2 U12.14 U12.17 U12.19

Pads without a net: U3 3 4 8 22 35 36 37 38 39 40; U8 4; U10 4

## Via types
v1: diameter 0.61, hole 0.305, Top Layer to Bottom Layer, 227 vias

## Routing (per net, layer and track width the routed paths; a pad name or vN(x,y) marks a point on that pad's centre or on a via; arc(x,y) is an arc through that point)
+5V: length 9.8
  Top Layer w0.254: U3.1 R1.1
  Inner2 w0.508: v1(15.88,7.18) 20.34,7.18 20.49,7.02 20.49,4.51 v1(20.62,4.38)
A1V: length 32.8
  Top Layer w0.406: 24.38,23.37 28.64,23.37 v1(28.64,23.36) ; 24.38,23.37 24.38,23.45 24.08,23.75 U12.26 ; 24.38,23.37 24.12,23.1 U12.25 ; C37.2 27.34,41.11 C32.2 25.55,41.12 24.11,41.12 ; 24.11,41.12 23.86,41.12 23.65,40.91 U1.25 ; 24.11,41.12 23.67,41.56 U1.26 ; U1.21 23.28,38.31 24.18,37.42 24.18,35.77 24.74,35.21 ; C53.2 23.88,18.86 23.88,19.59 22.96,20.5 U12.21
  Top Layer w0.508: v1(25.27,33.91) 25.27,35.11 25.18,35.21 24.74,35.21 ; v1(41.02,46.48) R8.2 ; C37.2 28.55,41.05 v1(28.57,41.02) ; C53.2 25.27,17.34 v1(25.27,16.13) ; R19.2 v1(41.02,28.58)
  vias: v1(48.77,18.29) v1(48.77,17.02) v1(48.77,15.75) v1(50.34,18.33) v1(50.3,17.02) v1(50.3,15.75) v1(52.1,18.29) v1(52.1,16.99) v1(52.1,15.75)
A3V3: length 36.9
  Top Layer w0.254: v1(23.53,17.96) 22.93,18.55 U12.18 ; v1(23.52,36.36) 23.51,36.36 U1.18
  Top Layer w0.508: C38.2 22.8,44.83 v1(23.88,44.83) ; C38.2 22.7,44.73 R13.2 ; C38.2 22.76,44.1 22.2,43.54 U1.28 ; v1(39.75,19.43) 39.75,22.8 C44.1 C45.1 41.31,24.89 U14.5 ; U13.5 32.89,29.17 C40.1 C41.1 32.89,32.71 v1(32.89,33.78) ; R24.2 22.67,26.92 22.61,26.86 22.61,26.16 22.17,25.73 U12.28 ; v1(39.88,37.34) 39.88,40.7 C24.1 C23.1 41.43,42.8 U5.5 ; v1(33.02,51.82) 33.02,50.61 C27.1 C28.1 33.02,47.08 U4.5 ; v1(23.88,26.99) C55.2
  vias: v1(26.54,56.26) v1(26.49,55.12) v1(26.54,53.97) v1(27.96,56.26) v1(27.96,55.12) v1(27.98,53.97) v1(29.27,56.26) v1(29.36,55.12) v1(29.36,53.97)
AGND: length 59.2
  Top Layer w0.406: v1(22.56,29.86) 22.73,29.68 C55.1 ; v1(21.06,29.84) 21.06,28.7 R25.1
  Top Layer w0.508: v1(20.65,19.98) 21.18,19.98 21.24,19.93 22.1,19.93 U12.20 ; v1(28.57,24.64) 28.51,24.7 C54.1 ; C46.1 48.51,23.24 v1(48.51,23.24) ; C30.1 32.43,40.66 v1(31.11,40.66) ; v1(30.23,50.61) C27.2 ; C36.1 28.04,35.21 v1(28.07,35.18) ; v1(32,38.99) 31.98,39.02 C35.1 ; v1(31.18,24.51) C43.1 ; v1(38.35,51.05) R9.1 ; v1(30.12,30.81) 30.15,30.78 C40.2 ; v1(37.14,42.8) 38.31,42.8 ; 38.31,42.8 38.41,42.8 C23.2 ; 38.31,42.8 38.42,42.69 C24.2 ; 38.31,42.8 38.31,42.8 ; 27.34,42.51 C37.1 ; 27.34,42.51 28.55,42.51 v1(28.58,42.54) ; 27.34,42.51 C32.1 ; v1(24.13,46.23) 24.1,46.19 C38.1 ; C44.2 38.28,22.86 v1(37.2,22.86) ; v1(32,37.23) 31.99,37.24 C33.1 ; v1(34.92,51.33) R7.2 ; C47.1 48.51,25.15 ; U1.20 22.13,37.73 21.27,37.73 21.09,37.91 v1(20.49,37.91) ; v1(34.8,33.4) R18.2 ; v1(53.09,41.13) 53.07,41.15 C26.1 ; v1(31.2,22.73) C42.1 ; v1(30.23,48.57) 31.5,48.57 C28.2 ; R14.1 20.95,46.39 v1(20.95,47.62) ; C53.1 v1(28,17.4) ; C25.1 48.89,43.05 v1(49.02,42.93) ; U12.1 v1(17.89,25.05) ; v1(37.2,24.89) C45.2 ; 30.42,21.21 v1(31.37,21.21) ; v1(31.11,42.55) 32.32,42.55 C29.1 ; v1(31.37,19.47) 31.33,19.43 30.42,19.43 ; U1.1 v1(17.99,42.86) ; R5.2 v1(46.1,47.75) ; v1(38.23,33.02) R20.1 ; C41.2 v1(30.12,32.7) ; R16.2 v1(45.97,29.46)
  vias: v1(19.81,61.98) v1(19.8,60.71) v1(21.65,61.98) v1(21.62,60.71) v1(21.59,59.44) v1(23.45,60.71) v1(23.45,59.31) v1(23.49,61.98) v1(23.75,56.9) v1(24.47,58.06) v1(25.23,61.93) v1(25.23,59.32) v1(25.27,60.72) v1(27.05,61.93) v1(27.05,60.71) v1(27.05,59.44) v1(28.83,61.97) v1(29,59.98) v1(29,58.33) v1(30.67,61.86) v1(30.67,59.98) v1(30.67,58.33) v1(44.58,10.54) v1(44.58,6.98) v1(44.96,14.22) v1(45.83,10.54) v1(47.12,12.32) v1(47.13,10.54) v1(47.11,8.68) v1(48.51,25.15) v1(48.77,13.97) v1(48.84,12.32) v1(48.82,10.54) v1(48.84,8.68) v1(48.84,7.05) v1(50.71,13.97) v1(50.66,12.32) v1(50.69,10.54) v1(50.71,8.68) v1(50.67,7.11) v1(52.1,14) v1(52.12,12.36) v1(52.12,10.52) v1(52.12,8.67) v1(52.12,7.05) v1(55.29,42.45) v1(55.31,29.6) v1(55.33,24.5) v1(55.44,47.51) v1(56.77,29.6) v1(56.77,24.5) v1(56.9,47.51) v1(56.9,42.41) v1(58.28,29.6) v1(58.3,24.5) v1(58.45,42.41) v1(58.48,47.51)
D3V3: length 23.1
  Top Layer w0.254: U9.2 U9.5
  Top Layer w0.406: v1(12.87,46.23) 12.87,44.61 13.57,43.91 C39.2 14.52,42.84 15.16,42.2 16.46,42.2 U1.2
  Top Layer w0.508: U12.2 15.35,24.4 14.48,25.27 C56.2 13.88,25.97 v1(12.19,27.66)
  Inner2 w0.508: v1(28.96,16) 33.06,16 v1(35.54,13.53)
  vias: v1(8.05,52.39) v1(8.05,50.95) v1(8.38,54.99) v1(8.76,53.85) v1(9.39,52.83) v1(9.4,51.05) v1(10.33,54.65) v1(10.64,52.32) v1(11.56,53.72) v1(27.94,13.97) v1(27.9,12.03) v1(27.94,10.47) v1(28.45,8.64) v1(29.21,12.99) v1(29.21,11.56) v1(29.34,14.48) v1(29.27,9.78) v1(29.72,8.41) v1(30.31,7.12) v1(31.24,16.32) v1(31.29,8.8) v1(31.8,7.4)
GND: length 13.5
  Top Layer w0.254: v1(1.32,8.6) LED1.1
  Top Layer w0.406: 14.52,45.31 v1(14.52,46.77)
  Top Layer w0.508: U12.17 v1(20.62,17.9) ; v1(15.04,34.41) U1.14 ; U1.17 22.19,35.72 v1(20.75,35.72) ; U12.19 22.1,19.13 21.24,19.13 21.19,19.09 v1(20.24,19.09) ; U12.14 15.09,16.6 v1(15.03,16.55) ; U1.19 22.13,36.94 21.27,36.94 21.09,36.76 v1(20.49,36.76) ; C56.1 14.52,27.42 v1(14.52,28.74)
  vias: v1(7.41,58.08) v1(8.13,61.47) v1(8.13,60.07) v1(9.41,61.47) v1(9.44,60.04) v1(9.4,58.67) v1(10.71,57.31) v1(10.93,60.04) v1(10.93,58.67) v1(10.97,61.5) v1(12.37,58.67) v1(12.46,60.04) v1(12.87,61.5) v1(13.21,5.21) v1(13.21,3.81) v1(13.21,2.23) v1(13.79,60.04) v1(13.79,58.67) v1(14.22,1.14) v1(14.91,61.5) v1(15.41,59.47) v1(15.99,1.14) v1(16.94,61.5) v1(17.91,2.54) v1(17.88,1.14) v1(20.23,2.54) v1(20.25,1.14) v1(22.39,1.27) v1(22.65,2.54) v1(22.73,3.94) v1(23.95,1.14) v1(26.47,1.14) v1(28.53,4.13) v1(28.53,2.66) v1(28.53,1.14) v1(31.24,14.73) v1(31.24,11.05) v1(33.53,13.46) v1(36.43,11.88) v1(36.83,15.29) v1(37.9,13.04) v1(37.9,11.88) v1(37.9,10.54) v1(39.28,10.54) v1(40.22,6.98) v1(40.26,14.48) v1(40.7,10.54) v1(42.21,12.29) v1(42.21,10.54) v1(42.21,8.95)
VEE: length 21
  Top Layer w0.508: 43.97,25.91 45.15,25.91 C47.2 C46.2 45.97,23.18 v1(45.97,21.97) ; v1(33.78,39.24) 33.78,40.58 C30.2 33.91,40.7 U4.2 ; v1(45.97,39.88) 45.97,41.09 C26.2 C25.2 45.27,43.81 U5.2 ; v1(33.7,21.63) 33.7,22.71 C42.2 C43.2 33.72,26.45 U13.2
  vias: v1(48.89,4.7) v1(48.89,3.43) v1(48.89,2.16) v1(50.46,4.7) v1(50.51,3.43) v1(50.47,2.2) v1(52.12,4.74) v1(52.12,3.41) v1(52.12,2.19)
AD1_CLK: length 9.5
  Top Layer w0.254: R12.1 8.47,32.04 U3.21
AD1_D0: length 16.6
  Top Layer w0.254: 16.44,41.53 U1.3 ; 16.44,41.53 14.85,41.53 4.7,51.69 U3.33
AD1_D1: length 19.4
  Top Layer w0.254: 16.44,40.88 14.49,40.88 4.86,50.51 2.7,50.51 U3.34
AD1_D2: length 16.1
  Top Layer w0.254: 16.47,40.26 U1.5 ; 16.44,40.23 14.12,40.23 5.21,49.15 U3.31
AD1_D3: length 18.9
  Top Layer w0.254: 16.44,39.58 13.76,39.58 5.37,47.97 2.7,47.97 U3.32 ; U1.6 16.46,39.62
AD1_D4: length 15.6
  Top Layer w0.254: U3.29 5.59,46.61 13.26,38.93 16.44,38.93
AD1_D5: length 18.4
  Top Layer w0.254: 16.44,38.28 13.02,38.28 5.97,45.34 2.79,45.34 U3.30 ; 16.43,38.35 U1.8
AD1_D6: length 15
  Top Layer w0.254: U3.27 6.22,44.07 12.66,37.63 16.43,37.63
AD1_D7: length 17.9
  Top Layer w0.254: 16.41,36.96 16.44,36.98 ; 16.41,36.96 12.44,36.96 6.51,42.89 2.7,42.89 U3.28 ; 16.41,36.96 U1.10
AD1_D8: length 14.5
  Top Layer w0.254: 16.44,36.33 16.43,36.32 11.94,36.32 6.73,41.53 U3.25
AD1_D9: length 17.3
  Top Layer w0.254: 16.44,35.68 11.45,35.68 6.79,40.35 2.7,40.35 U3.26
AD1_OE: length 23.4
  Top Layer w0.254: 22.17,35.03 19.54,35.03 18.16,33.66 9.65,33.66 5.5,37.81 2.7,37.81 U3.24
AD1_OTR: length 14
  Top Layer w0.254: 16.44,35.03 10.94,35.03 6.98,38.99 U3.23
AD2_CLK: length 9.5
  Top Layer w0.254: 11.73,14.22 8.47,14.22 4.06,18.62
AD2_D0: length 16.6
  Top Layer w0.254: U3.19 4.7,33.91 14.85,23.75 U12.3
AD2_D1: length 19.4
  Top Layer w0.254: U3.20 2.7,32.73 4.86,32.73 14.49,23.1 U12.4
AD2_D2: length 16.1
  Top Layer w0.254: U12.5 14.12,22.45 5.21,31.37 U3.17
AD2_D3: length 18.9
  Top Layer w0.254: U3.18 2.7,30.19 5.37,30.19 13.76,21.8 U12.6
AD2_D4: length 15.6
  Top Layer w0.254: U3.15 5.59,28.83 13.26,21.15 U12.7
AD2_D5: length 18.4
  Top Layer w0.254: U3.16 2.79,27.56 5.97,27.56 13.08,20.45 16.38,20.45 U12.8
AD2_D6: length 15
  Top Layer w0.254: U12.9 12.66,19.85 6.22,26.29 U3.13
AD2_D7: length 17.9
  Top Layer w0.254: U12.10 16.41,19.18 12.45,19.18 6.51,25.11 2.7,25.11 U3.14
AD2_D8: length 14.5
  Top Layer w0.254: U12.11 16.43,18.54 11.94,18.54 6.73,23.75 U3.11
AD2_D9: length 17.3
  Top Layer w0.254: U12.12 11.45,17.9 6.79,22.57 2.7,22.57 U3.12
AD2_OE: length 23.4
  Top Layer w0.254: U3.10 2.7,20.03 5.5,20.03 9.65,15.88 18.16,15.88 19.54,17.25 U12.16
AD2_OTR: length 14
  Top Layer w0.254: U12.13 10.94,17.25 6.98,21.21 U3.9
$1N3788: length 3.8
  Top Layer w0.406: U5.3 47.82,44.77 R4.2
$1N3795: length 7.6
  Top Layer w0.406: R4.1 56.77,44.83 56.9,44.96
$1N3801: length 5
  Top Layer w0.406: U5.1 43.4,42.86 U5.4 41.44,44.7 R6.2
$1N4223: length 7.1
  Top Layer w0.406: R9.2 38.36,48.13 R8.1 R6.1 38.08,44.42 U4.3
$1N4309: length 5.9
  Top Layer w0.406: R7.1 34.86,48.46 U4.4 34.86,46.42 34.41,45.97 R10.1
$1N5649: length 5.3
  Top Layer w0.406: R11.2 25.79,44.32 24.64,44.32 24.13,43.81 24.13,42.67 23.67,42.21 U1.27
$1N5655: length 5.6
  Top Layer w0.406: U4.1 32.92,44.46 R10.2 27.43,44.46 R11.1
$1N5774: length 7.5
  Top Layer w0.406: U1.24 24.43,40.26 C31.2 26.02,39.25 26.42,38.86 28.89,38.86 C35.2
$1N5832: length 8.9
  Top Layer w0.406: 19.45,46.38 19.45,44.75 R13.1 19.47,40.73 20.57,39.62 22.19,39.62 U1.23
$1N5839: length 7.6
  Top Layer w0.406: C33.2 28.95,37.34 26.42,37.34 26.33,37.25 C31.1 23.73,38.96 U1.22
$1N5992: length 9.9
  Top Layer w0.254: R12.2 17.87,32.04 20.24,34.41 U1.15
$2N1318: length 4.6
  Top Layer w0.508: v1(35.5,5.92) U9.3
  Inner2 w0.508: v1(35.32,2.54) 35.5,2.72 v1(35.5,5.92)
$2N1401: length 1.9
  Top Layer w0.508: C19.2 37.4,2.62 U9.6
$2N1421: length 1.8
  Top Layer w0.254: R1.2 3.94,7 LED1.2
$3N1432: length 3.8
  Top Layer w0.406: 43.97,26.86 45.9,26.86 R16.1 45.98,26.92 R15.2
$3N1436: length 7.6
  Top Layer w0.406: RF2.5 56.64,26.92 R15.1
$3N1441: length 5
  Top Layer w0.406: 43.97,24.96 43.27,24.96 U14.4 41.31,26.8 R17.2
$3N1463: length 7.1
  Top Layer w0.406: U13.3 35.02,26.8 R17.1 R19.1 38.24,30.23 R20.2
$3N1473: length 6
  Top Layer w0.406: R18.1 34.8,29.18 U13.4 34.73,28.38 34.42,28.07 31.12,28.07 R21.1
$3N1502: length 5.2
  Top Layer w0.406: U12.27 23.72,24.4 24.13,24.81 24.13,26.03 24.64,26.54 R22.2
$3N1505: length 5.5
  Top Layer w0.406: R22.1 31.12,26.54 31.15,26.51 U13.1
$3N1522: length 7.5
  Top Layer w0.406: U12.24 24.39,22.45 C48.2 26.88,21.45 C51.2 28.83,21.02 C52.2
$3N1528: length 9.1
  Top Layer w0.254: R25.2 19.44,28.56 R24.1 19.44,22.47 20.11,21.8 U12.23
$3N1534: length 7.7
  Top Layer w0.406: C50.2 28.83,19.62 C51.1 27.13,19.45 C48.1 23.69,21.15 U12.22
$3N1555: length 9.9
  Top Layer w0.254: 22.2,16.59 20.23,16.59 17.86,14.22 13.24,14.22

## Copper pours and planes (outline as drawn; the poured copper is in the pictures)
+5V on Top Layer: 0.38,11.94 21.11,11.94 21.11,6.35 0.38,6.35
+5V on Top Layer: 20.07,5.59 21.21,5.59 21.21,3.81 20.07,3.81
-3V3 on Top Layer: 37.08,7.62 42.93,7.62 42.93,2.13 37.08,2.13
A1V on Top Layer: 44.07,19.54 53.21,19.54 53.21,14.99 44.07,14.99
A1V on Bottom Layer: 23.46,52 23.46,14.82 27.12,14.82 31.03,18.07 46.66,18.07 47.04,17.69 47.04,15.31 47.52,14.83 53.32,14.83 53.32,52
A1V on Bottom Layer: 47.8,19.34 53.21,19.34 53.21,14.99 47.8,14.99
A3V3 on Top Layer: 18.8,57.15 30.35,57.15 30.35,53.34 18.8,53.34
A3V3 on Inner2: 37.13,57.19 44.88,49.44 44.62,49.19 44.62,40.55 32.56,40.55 32.07,41.04 32.07,37.74 32.43,37.38 36.24,37.38 36.62,37.76 50.21,37.76 50.72,37.25 50.72,24.29 50.59,24.17 31.8,24.17 30.84,23.21 31.44,20.1 47.5,20.1 47.5,16.93 19.86,16.93 19.86,53.19 23.85,57.19
AGND on Top Layer: 18.82,55.92 23.06,55.92 23.95,55.03 25.14,55.03 25.14,57.52 25.32,57.69 32.18,57.69 32.18,62.9 31.92,62.65 18.84,62.65 18.82,62.63
AGND on Top Layer: 43.81,14.99 53.21,14.99 53.21,6.1 43.81,6.1
AGND on Inner1: -9.1,65.95 66.97,65.95 66.97,-10.5 -9.1,-10.5
D1V on Top Layer: 37.53,19.05 43.56,19.05 43.56,15.37 37.53,15.37
D3V3 on Top Layer: 7.49,55.5 18.03,55.5 18.03,50.29 7.49,50.29
D3V3 on Top Layer: 34.92,14.73 36.19,14.73 36.19,12.95 34.92,12.95
D3V3 on Top Layer: 27.38,17.14 36.18,17.14 36.18,6.92 27.38,6.92
D3V3 on Top Layer: 27.43,9.43 33.2,9.43 33.2,6.73 27.43,6.73
D3V3 on Top Layer: 26.03,7.87 29.17,7.87 29.17,6.94 26.03,6.94
D3V3 on Top Layer: 22.3,9.65 36.98,9.65 36.98,6.48 22.3,6.48
D3V3 on Inner2: 13.38,55.41 6.4,55.41 6.4,14.01 12.11,8.29 27.56,8.29 29.08,6.77 32.18,6.77 33.07,7.66 33.07,9.44 29.85,9.44 29.64,9.64 29.89,9.9 29.89,17.18 14.01,17.18 13.56,16.73 13.56,30.08 13.38,30.26
GND on Top Layer: 28.75,6.13 37.76,6.13 37.89,6.01 37.89,5.01 38.73,4.17 40.39,4.17 41.16,3.4 40.69,2.93 40.69,0.29 29.76,0.29 28.75,1.31
GND on Top Layer: 7.78,55.81 12.85,55.81 13,55.66 17.8,55.66 18.05,55.41 18.05,62.55 17.95,62.65 6.14,62.65 6.02,62.77 6.02,55.8 7.77,55.8
GND on Top Layer: 17.14,6.35 17.4,6.6 23.28,6.6 23.79,6.1 29.05,6.1 29.69,5.46 29.69,0.48 29.59,0.38 11.93,0.38 11.93,5.84 12.57,6.48 12.83,6.48 12.95,6.35
GND on Top Layer: 29.97,15.49 34.54,15.49 34.8,15.75 37.34,15.75 38.23,14.86 41.73,14.86 41.96,15.09 43.33,15.09 43.43,14.99 43.43,6.27 43.38,6.22 40.01,6.22 38.48,7.75 38.48,8.64 37.59,9.53 35.81,9.53 35.31,10.03 30.1,10.03 29.97,10.16
GND on Bottom Layer: -3.64,71.03 78.79,71.03 78.79,-10.76 -3.64,-10.76
VEE on Top Layer: 43.69,6.22 53.21,6.22 53.21,1.19 43.69,1.19
VEE on Inner2: 47.92,5.62 58.47,5.62 58.47,1.18 47.92,1.18
VEE on Inner2: 33,40.37 57.76,40.37 58.85,39.28 58.69,1.05 53.51,1.05 53.51,20.74 32.34,20.74 32.34,23.93 51.88,23.93 51.99,24.04 51.99,37.31 52.07,37.39 51.07,38.39 33,38.39

Small or netless copper shapes (teardrops, artwork), in the pictures only: 306 on Top Layer, 1 on Bottom Layer, 6 on Inner2

## Text on the board
Top Silkscreen Layer: 3PA1030 | By Juto | 10bit 50MSPS
